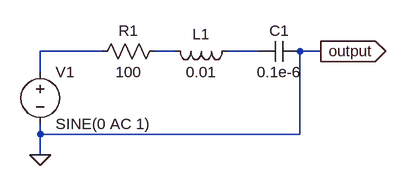
[diagram p0: schematic rlc_bandpass.asc]
rlc_bandpass.asc, the LTspice schematic file:
Version 4
SHEET 1 880 680
WIRE 192 128 96 128
WIRE 304 128 272 128
WIRE 432 128 384 128
WIRE 528 128 496 128
WIRE 96 160 96 128
WIRE 96 256 96 240
WIRE 496 256 496 128
WIRE 496 256 96 256
WIRE 96 288 96 256
FLAG 96 288 0
FLAG 528 128 output
IOPIN 528 128 Out
SYMBOL voltage 96 144 R0
WINDOW 123 0 0 Left 0
WINDOW 39 0 0 Left 0
SYMATTR InstName V1
SYMATTR Value SINE(0 AC 1)
SYMBOL res 288 112 R90
WINDOW 0 0 56 VBottom 2
WINDOW 3 32 56 VTop 2
SYMATTR InstName R1
SYMATTR Value 100
SYMBOL cap 496 112 R90
WINDOW 0 0 32 VBottom 2
WINDOW 3 32 32 VTop 2
SYMATTR InstName C1
SYMATTR Value 0.1e-6
SYMBOL ind 400 112 R90
WINDOW 0 5 56 VBottom 2
WINDOW 3 32 56 VTop 2
SYMATTR InstName L1
SYMATTR Value 0.01

The netlist it stands for:
* rlc_bandpass.asc
V1 N001 0 SINE(0 AC 1)
R1 N002 N001 100
C1 0 N003 0.1e-6
L1 N003 N002 0.01
.backanno
.end